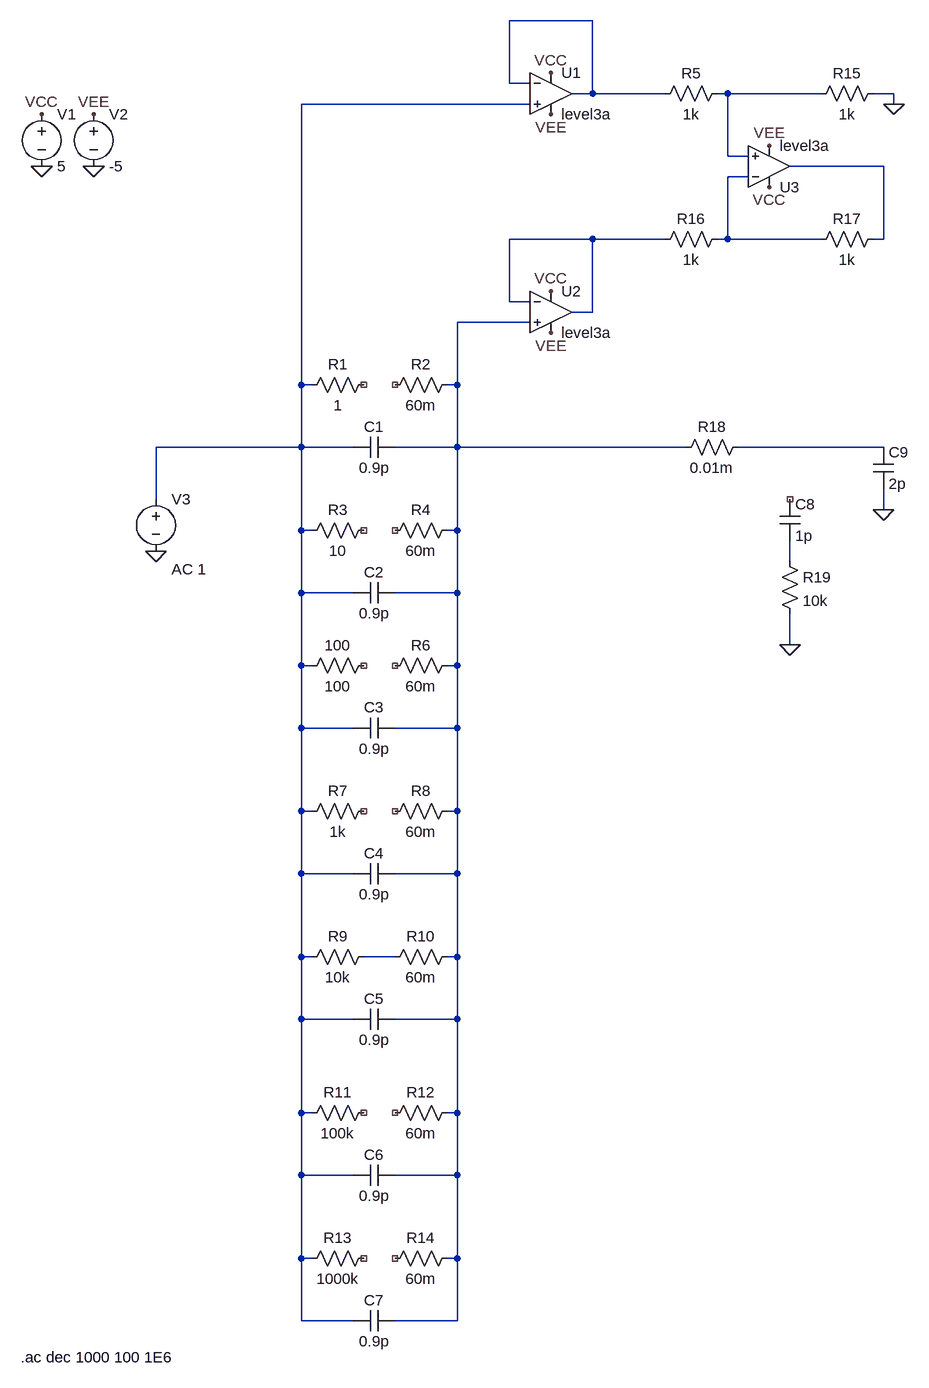
[diagram p0: schematic Draft1.asc]
Draft1.asc, the LTspice schematic file:
Version 4
SHEET 1 1016 1576
WIRE 528 -496 400 -496
WIRE 400 -400 400 -496
WIRE 432 -400 400 -400
WIRE 528 -384 528 -496
WIRE 528 -384 496 -384
WIRE 640 -384 528 -384
WIRE 736 -384 720 -384
WIRE 880 -384 736 -384
WIRE 992 -384 960 -384
WIRE 432 -368 80 -368
WIRE 992 -368 992 -384
WIRE 736 -288 736 -384
WIRE 768 -288 736 -288
WIRE 976 -272 832 -272
WIRE 768 -256 736 -256
WIRE 528 -160 400 -160
WIRE 640 -160 528 -160
WIRE 736 -160 736 -256
WIRE 736 -160 720 -160
WIRE 880 -160 736 -160
WIRE 976 -160 976 -272
WIRE 976 -160 960 -160
WIRE 400 -64 400 -160
WIRE 432 -64 400 -64
WIRE 528 -48 528 -160
WIRE 528 -48 496 -48
WIRE 432 -32 320 -32
WIRE 80 64 80 -368
WIRE 96 64 80 64
WIRE 320 64 320 -32
WIRE 320 64 304 64
WIRE 80 160 80 64
WIRE 80 160 -144 160
WIRE 160 160 80 160
WIRE 320 160 320 64
WIRE 320 160 224 160
WIRE 672 160 320 160
WIRE 976 160 752 160
WIRE -144 240 -144 160
WIRE 976 256 976 224
WIRE 80 288 80 160
WIRE 96 288 80 288
WIRE 320 288 320 160
WIRE 320 288 304 288
WIRE 832 336 832 304
WIRE 80 384 80 288
WIRE 160 384 80 384
WIRE 320 384 320 288
WIRE 320 384 224 384
WIRE 832 464 832 416
WIRE 80 496 80 384
WIRE 96 496 80 496
WIRE 320 496 320 384
WIRE 320 496 304 496
WIRE 80 592 80 496
WIRE 160 592 80 592
WIRE 320 592 320 496
WIRE 320 592 224 592
WIRE 80 720 80 592
WIRE 96 720 80 720
WIRE 320 720 320 592
WIRE 320 720 304 720
WIRE 80 816 80 720
WIRE 160 816 80 816
WIRE 320 816 320 720
WIRE 320 816 224 816
WIRE 80 944 80 816
WIRE 96 944 80 944
WIRE 224 944 176 944
WIRE 320 944 320 816
WIRE 320 944 304 944
WIRE 80 1040 80 944
WIRE 160 1040 80 1040
WIRE 320 1040 320 944
WIRE 320 1040 224 1040
WIRE 80 1184 80 1040
WIRE 96 1184 80 1184
WIRE 320 1184 320 1040
WIRE 320 1184 304 1184
WIRE 80 1280 80 1184
WIRE 160 1280 80 1280
WIRE 320 1280 320 1184
WIRE 320 1280 224 1280
WIRE 80 1408 80 1280
WIRE 96 1408 80 1408
WIRE 320 1408 320 1280
WIRE 320 1408 304 1408
WIRE 80 1504 80 1408
WIRE 160 1504 80 1504
WIRE 320 1504 320 1408
WIRE 320 1504 224 1504
FLAG -240 -272 0
FLAG -320 -272 0
FLAG -320 -352 VCC
FLAG 464 -416 VCC
FLAG -240 -352 VEE
FLAG 464 -352 VEE
FLAG 464 -80 VCC
FLAG 464 -16 VEE
FLAG 800 -240 VCC
FLAG 800 -304 VEE
FLAG 992 -368 0
FLAG -144 320 0
FLAG 832 464 0
FLAG 976 256 0
SYMBOL res 192 48 R90
WINDOW 0 0 56 VBottom 2
WINDOW 3 32 56 VTop 2
SYMATTR InstName R1
SYMATTR Value 1
SYMBOL res 320 48 R90
WINDOW 0 0 56 VBottom 2
WINDOW 3 32 56 VTop 2
SYMATTR InstName R2
SYMATTR Value 60m
SYMBOL cap 224 144 R90
WINDOW 0 0 32 VBottom 2
WINDOW 3 32 32 VTop 2
SYMATTR InstName C1
SYMATTR Value 0.9p
SYMBOL res 192 272 R90
WINDOW 0 0 56 VBottom 2
WINDOW 3 32 56 VTop 2
SYMATTR InstName R3
SYMATTR Value 10
SYMBOL res 320 272 R90
WINDOW 0 0 56 VBottom 2
WINDOW 3 32 56 VTop 2
SYMATTR InstName R4
SYMATTR Value 60m
SYMBOL cap 224 368 R90
WINDOW 0 0 32 VBottom 2
WINDOW 3 32 32 VTop 2
SYMATTR InstName C2
SYMATTR Value 0.9p
SYMBOL res 192 480 R90
WINDOW 0 0 56 VBottom 2
WINDOW 3 32 56 VTop 2
SYMATTR InstName 100
SYMATTR Value 100
SYMBOL res 320 480 R90
WINDOW 0 0 56 VBottom 2
WINDOW 3 32 56 VTop 2
SYMATTR InstName R6
SYMATTR Value 60m
SYMBOL cap 224 576 R90
WINDOW 0 0 32 VBottom 2
WINDOW 3 32 32 VTop 2
SYMATTR InstName C3
SYMATTR Value 0.9p
SYMBOL res 192 704 R90
WINDOW 0 0 56 VBottom 2
WINDOW 3 32 56 VTop 2
SYMATTR InstName R7
SYMATTR Value 1k
SYMBOL res 320 704 R90
WINDOW 0 0 56 VBottom 2
WINDOW 3 32 56 VTop 2
SYMATTR InstName R8
SYMATTR Value 60m
SYMBOL cap 224 800 R90
WINDOW 0 0 32 VBottom 2
WINDOW 3 32 32 VTop 2
SYMATTR InstName C4
SYMATTR Value 0.9p
SYMBOL res 192 928 R90
WINDOW 0 0 56 VBottom 2
WINDOW 3 32 56 VTop 2
SYMATTR InstName R9
SYMATTR Value 10k
SYMBOL res 320 928 R90
WINDOW 0 0 56 VBottom 2
WINDOW 3 32 56 VTop 2
SYMATTR InstName R10
SYMATTR Value 60m
SYMBOL cap 224 1024 R90
WINDOW 0 0 32 VBottom 2
WINDOW 3 32 32 VTop 2
SYMATTR InstName C5
SYMATTR Value 0.9p
SYMBOL res 192 1168 R90
WINDOW 0 0 56 VBottom 2
WINDOW 3 32 56 VTop 2
SYMATTR InstName R11
SYMATTR Value 100k
SYMBOL res 320 1168 R90
WINDOW 0 0 56 VBottom 2
WINDOW 3 32 56 VTop 2
SYMATTR InstName R12
SYMATTR Value 60m
SYMBOL cap 224 1264 R90
WINDOW 0 0 32 VBottom 2
WINDOW 3 32 32 VTop 2
SYMATTR InstName C6
SYMATTR Value 0.9p
SYMBOL res 192 1392 R90
WINDOW 0 0 56 VBottom 2
WINDOW 3 32 56 VTop 2
SYMATTR InstName R13
SYMATTR Value 1000k
SYMBOL res 320 1392 R90
WINDOW 0 0 56 VBottom 2
WINDOW 3 32 56 VTop 2
SYMATTR InstName R14
SYMATTR Value 60m
SYMBOL cap 224 1488 R90
WINDOW 0 0 32 VBottom 2
WINDOW 3 32 32 VTop 2
SYMATTR InstName C7
SYMATTR Value 0.9p
SYMBOL voltage -320 -368 R0
WINDOW 123 0 0 Left 0
WINDOW 39 0 0 Left 0
SYMATTR InstName V1
SYMATTR Value 5
SYMBOL voltage -240 -368 R0
WINDOW 123 0 0 Left 0
WINDOW 39 0 0 Left 0
SYMATTR InstName V2
SYMATTR Value -5
SYMBOL OpAmps\\UniversalOpAmp3 464 -384 R0
SYMATTR InstName U1
SYMATTR Value2 Avol=100Meg GBW=10000Meg Slew=10000Meg
SYMATTR SpiceLine2 En=0 Enk=0 In=0 Ink=0 Rin=500000Meg
SYMBOL OpAmps\\UniversalOpAmp3 464 -48 R0
SYMATTR InstName U2
SYMATTR Value2 Avol=100Meg GBW=10000Meg Slew=10000Meg
SYMATTR SpiceLine2 En=0 Enk=0 In=0 Ink=0 Rin=500000Meg
SYMBOL OpAmps\\UniversalOpAmp3 800 -272 M180
SYMATTR InstName U3
SYMATTR Value2 Avol=100Meg GBW=10000Meg Slew=10000Meg
SYMATTR SpiceLine2 En=0 Enk=0 In=0 Ink=0 Rin=500000Meg
SYMBOL res 736 -400 R90
WINDOW 0 0 56 VBottom 2
WINDOW 3 32 56 VTop 2
SYMATTR InstName R5
SYMATTR Value 1k
SYMBOL res 976 -400 R90
WINDOW 0 0 56 VBottom 2
WINDOW 3 32 56 VTop 2
SYMATTR InstName R15
SYMATTR Value 1k
SYMBOL res 736 -176 R90
WINDOW 0 0 56 VBottom 2
WINDOW 3 32 56 VTop 2
SYMATTR InstName R16
SYMATTR Value 1k
SYMBOL res 976 -176 R90
WINDOW 0 0 56 VBottom 2
WINDOW 3 32 56 VTop 2
SYMATTR InstName R17
SYMATTR Value 1k
SYMBOL res 656 176 R270
WINDOW 0 32 56 VTop 2
WINDOW 3 0 56 VBottom 2
SYMATTR InstName R18
SYMATTR Value 0.01m
SYMBOL cap 816 240 R0
SYMATTR InstName C8
SYMATTR Value 1p
SYMBOL voltage -144 224 R0
WINDOW 123 24 124 Left 2
WINDOW 39 0 0 Left 0
SYMATTR InstName V3
SYMATTR Value ""
SYMATTR Value2 AC 1
SYMBOL res 816 320 R0
SYMATTR InstName R19
SYMATTR Value 10k
SYMBOL cap 960 160 R0
SYMATTR InstName C9
SYMATTR Value 2p
TEXT -352 1560 Left 2 !.ac dec 1000 100 1E6

The netlist it stands for:
* Draft1.asc
R1 NC_01 N003 1
R2 N007 NC_02 60m
C1 N007 N003 0.9p
R3 NC_03 N003 10
R4 N007 NC_04 60m
C2 N007 N003 0.9p
R§100 NC_05 N003 100
R6 N007 NC_06 60m
C3 N007 N003 0.9p
R7 NC_07 N003 1k
R8 N007 NC_08 60m
C4 N007 N003 0.9p
R9 N010 N003 10k
R10 N007 N010 60m
C5 N007 N003 0.9p
R11 NC_09 N003 100k
R12 N007 NC_10 60m
C6 N007 N003 0.9p
R13 NC_11 N003 1000k
R14 N007 NC_12 60m
C7 N007 N003 0.9p
V1 VCC 0 5
V2 VEE 0 -5
XU1 N003 N001 VCC VEE N001 level3a Avol=100Meg GBW=10000Meg Slew=10000Meg En=0 Enk=0 In=0 Ink=0 Rin=500000Meg  ; pins In+ In- V+ V- OUT
XU2 N007 N006 VCC VEE N006 level3a Avol=100Meg GBW=10000Meg Slew=10000Meg En=0 Enk=0 In=0 Ink=0 Rin=500000Meg  ; pins In+ In- V+ V- OUT
XU3 N002 N005 VCC VEE N004 level3a Avol=100Meg GBW=10000Meg Slew=10000Meg En=0 Enk=0 In=0 Ink=0 Rin=500000Meg  ; pins In+ In- V+ V- OUT
R5 N002 N001 1k
R15 0 N002 1k
R16 N005 N006 1k
R17 N004 N005 1k
R18 N007 N008 0.01m
C8 NC_13 N009 1p
V3 N003 0 AC 1
R19 N009 0 10k
C9 N008 0 2p
.ac dec 1000 100 1E6
.backanno
.end